# Altium project STB_LightBoard.PrjPcb (part 10 of 10)
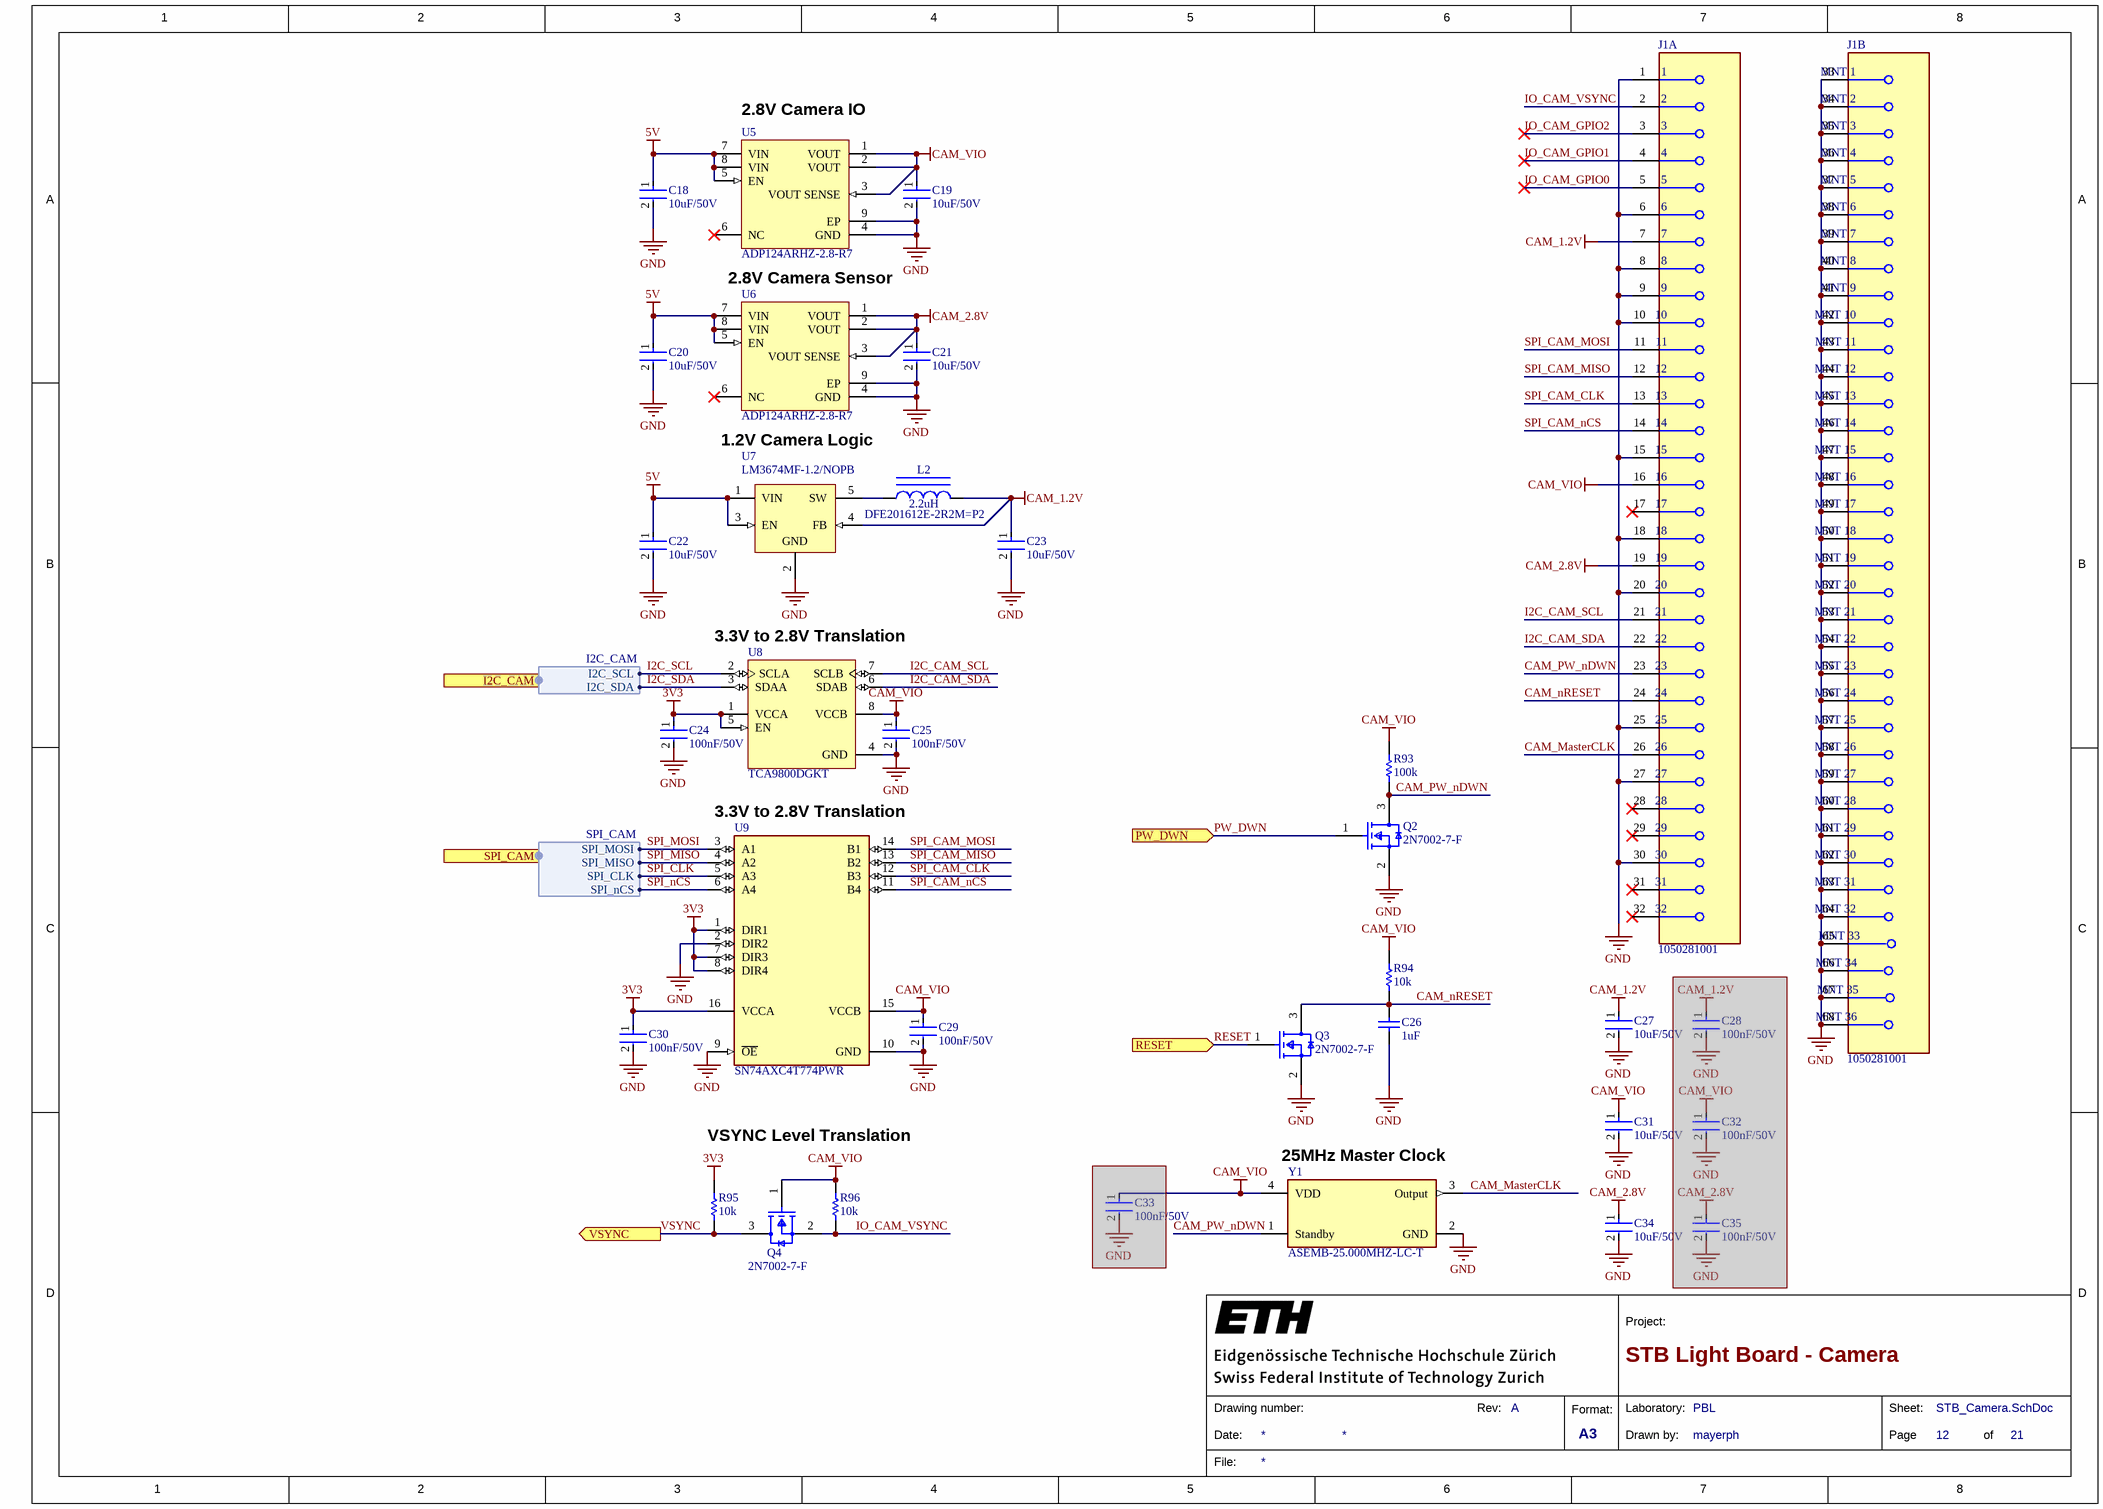
[diagram p21: STB_Camera.SchDoc]

## Nets that join several sheets
3V3: STB_LightBoard (X3.1), STB_UID (C4.2 U2.A1), TC1 (5 pins), TC2 (6 pins), LED_Driver_NE2G757GT (R85.2 R87.2), LG/D26 (5 pins), LED_Driver_QBHP686 (6 pins), LIR1/D15 (5 pins), LIR1/D16 (5 pins), LIR1/D17 (5 pins), LIR1/D18 (5 pins), LED_Driver_AREM-80C0 (R61.2 R62.2 R65.2 R66.2), LIR2/D19 (5 pins), LIR2/D20 (5 pins), LED_Driver_AREM-90C0 (8 pins), LIR3/D21 (5 pins), LIR3/D22 (5 pins), LIR3/D23 (5 pins), LIR3/D24 (5 pins), LED_Driver_NF2L757GT-F1 (5 pins), LW2/D10 (5 pins), LW2/D11 (5 pins), LW2/D12 (5 pins), LW2/D13 (5 pins), LW2/D14 (5 pins), LED_Driver_NF2W757GT-F1 (9 pins), LW1/D0 (5 pins), LW1/D1 (5 pins), LW1/D2 (5 pins), LW1/D3 (5 pins), LW1/D5 (5 pins), LW1/D6 (5 pins), LW1/D7 (5 pins), LW1/D4 (5 pins), LW1/D9 (5 pins), LW1/D8 (5 pins), LED_Driver_NE2R757GT-P6 (R89.2 R91.2), LR/D27 (5 pins), LED_Driver_NE2B757GT (R40.2 R42.2), LB/D25 (5 pins), STB_Camera (9 pins)
5V: STB_LightBoard (X3.19), STB_Camera (11 pins)
12V: STB_LightBoard (X3.17), TC1 (6 pins), TC2 (6 pins)
24V: STB_LightBoard (5 pins), LG/D26 (8 pins), LIR1/D15 (8 pins), LIR1/D16 (8 pins), LIR1/D17 (8 pins), LIR1/D18 (8 pins), LIR2/D19 (8 pins), LIR2/D20 (8 pins), LIR3/D21 (8 pins), LIR3/D22 (8 pins), LIR3/D23 (8 pins), LIR3/D24 (8 pins), LW2/D10 (8 pins), LW2/D11 (8 pins), LW2/D12 (8 pins), LW2/D13 (8 pins), LW2/D14 (8 pins), LW1/D0 (8 pins), LW1/D1 (8 pins), LW1/D2 (8 pins), LW1/D3 (8 pins), LW1/D5 (8 pins), LW1/D6 (8 pins), LW1/D7 (8 pins), LW1/D4 (8 pins), LW1/D9 (8 pins), LW1/D8 (8 pins), LR/D27 (8 pins), LB/D25 (8 pins)
GND: STB_LightBoard (7 pins), STB_UID (C4.1 U2.A2), TC1 (8 pins), TC2 (7 pins), LED_Driver_NE2G757GT (R86.1 R88.1), LG/D26 (20 pins), LED_Driver_QBHP686 (5 pins), LIR1/D15 (21 pins), LIR1/D16 (21 pins), LIR1/D17 (20 pins), LIR1/D18 (20 pins), LED_Driver_AREM-80C0 (R63.1 R64.1 R67.1 R68.1), LIR2/D19 (20 pins), LIR2/D20 (20 pins), LED_Driver_AREM-90C0 (8 pins), LIR3/D21 (20 pins), LIR3/D22 (20 pins), LIR3/D23 (20 pins), LIR3/D24 (20 pins), LED_Driver_NF2L757GT-F1 (5 pins), LW2/D10 (21 pins), LW2/D11 (21 pins), LW2/D12 (21 pins), LW2/D13 (21 pins), LW2/D14 (21 pins), LED_Driver_NF2W757GT-F1 (9 pins), LW1/D0 (22 pins), LW1/D1 (21 pins), LW1/D2 (21 pins), LW1/D3 (21 pins), LW1/D5 (21 pins), LW1/D6 (21 pins), LW1/D7 (21 pins), LW1/D4 (21 pins), LW1/D9 (21 pins), LW1/D8 (21 pins), LED_Driver_NE2R757GT-P6 (R90.1 R92.1), LR/D27 (20 pins), LED_Driver_NE2B757GT (R41.1 R43.1), LB/D25 (20 pins), STB_Camera (73 pins)
GPIO3: STB_LightBoard (X3.15), TC1 (R49_TC1.1 U1_TC1.9)
GPIO4: STB_LightBoard (X3.13), TC2 (R49_TC2.1 U1_TC2.9)
I2C_LIGHT_SCL: STB_LightBoard (X3.11), STB_UID (U2.B1), TC1 (U1_TC1.14), TC2 (U1_TC2.14), LG/D26 (U4_D26.10), LIR1/D15 (U4_D15.10), LIR1/D16 (U4_D16.10), LIR1/D17 (U4_D17.10), LIR1/D18 (U4_D18.10), LIR2/D19 (U4_D19.10), LIR2/D20 (U4_D20.10), LIR3/D21 (U4_D21.10), LIR3/D22 (U4_D22.10), LIR3/D23 (U4_D23.10), LIR3/D24 (U4_D24.10), LW2/D10 (U4_D10.10), LW2/D11 (U4_D11.10), LW2/D12 (U4_D12.10), LW2/D13 (U4_D13.10), LW2/D14 (U4_D14.10), LW1/D0 (U4_D0.10), LW1/D1 (U4_D1.10), LW1/D2 (U4_D2.10), LW1/D3 (U4_D3.10), LW1/D5 (U4_D5.10), LW1/D6 (U4_D6.10), LW1/D7 (U4_D7.10), LW1/D4 (U4_D4.10), LW1/D9 (U4_D9.10), LW1/D8 (U4_D8.10), LR/D27 (U4_D27.10), LB/D25 (U4_D25.10)
I2C_LIGHT_SDA: STB_LightBoard (X3.9), STB_UID (U2.B2), TC1 (U1_TC1.13), TC2 (U1_TC2.13), LG/D26 (U4_D26.7), LIR1/D15 (U4_D15.7), LIR1/D16 (U4_D16.7), LIR1/D17 (U4_D17.7), LIR1/D18 (U4_D18.7), LIR2/D19 (U4_D19.7), LIR2/D20 (U4_D20.7), LIR3/D21 (U4_D21.7), LIR3/D22 (U4_D22.7), LIR3/D23 (U4_D23.7), LIR3/D24 (U4_D24.7), LW2/D10 (U4_D10.7), LW2/D11 (U4_D11.7), LW2/D12 (U4_D12.7), LW2/D13 (U4_D13.7), LW2/D14 (U4_D14.7), LW1/D0 (U4_D0.7), LW1/D1 (U4_D1.7), LW1/D2 (U4_D2.7), LW1/D3 (U4_D3.7), LW1/D5 (U4_D5.7), LW1/D6 (U4_D6.7), LW1/D7 (U4_D7.7), LW1/D4 (U4_D4.7), LW1/D9 (U4_D9.7), LW1/D8 (U4_D8.7), LR/D27 (U4_D27.7), LB/D25 (U4_D25.7)
I2C_SCL: STB_LightBoard (X4.9), STB_Camera (U8.2)
I2C_SDA: STB_LightBoard (X4.7), STB_Camera (U8.3)
NetC7_D0_2: LW1/D0 (7 pins), LW1/W5_10 (LED65_W5_10.2), LW1/W5_11 (LED65_W5_11.2), LW1/W5_12 (LED65_W5_12.2), LW1/W5_13 (LED65_W5_13.2), LW1/W5_14 (LED65_W5_14.2), LW1/W5_15 (LED65_W5_15.2)
NetC7_D1_2: LW1/D1 (7 pins), LW1/W5_20 (LED65_W5_20.2), LW1/W5_21 (LED65_W5_21.2), LW1/W5_22 (LED65_W5_22.2), LW1/W5_23 (LED65_W5_23.2), LW1/W5_24 (LED65_W5_24.2), LW1/W5_25 (LED65_W5_25.2)
NetC7_D2_2: LW1/D2 (7 pins), LW1/W5_30 (LED65_W5_30.2), LW1/W5_31 (LED65_W5_31.2), LW1/W5_32 (LED65_W5_32.2), LW1/W5_33 (LED65_W5_33.2), LW1/W5_34 (LED65_W5_34.2), LW1/W5_35 (LED65_W5_35.2)
NetC7_D3_2: LW1/D3 (7 pins), LW1/W5_40 (LED65_W5_40.2), LW1/W5_41 (LED65_W5_41.2), LW1/W5_42 (LED65_W5_42.2), LW1/W5_43 (LED65_W5_43.2), LW1/W5_44 (LED65_W5_44.2), LW1/W5_45 (LED65_W5_45.2)
NetC7_D4_2: LW1/D4 (7 pins), LW1/W5_50 (LED65_W5_50.2), LW1/W5_51 (LED65_W5_51.2), LW1/W5_52 (LED65_W5_52.2), LW1/W5_53 (LED65_W5_53.2), LW1/W5_54 (LED65_W5_54.2), LW1/W5_55 (LED65_W5_55.2)
NetC7_D5_2: LW1/D5 (7 pins), LW1/W5_60 (LED65_W5_60.2), LW1/W5_61 (LED65_W5_61.2), LW1/W5_62 (LED65_W5_62.2), LW1/W5_63 (LED65_W5_63.2), LW1/W5_64 (LED65_W5_64.2), LW1/W5_65 (LED65_W5_65.2)
NetC7_D6_2: LW1/D6 (7 pins), LW1/W5_70 (LED65_W5_70.2), LW1/W5_71 (LED65_W5_71.2), LW1/W5_72 (LED65_W5_72.2), LW1/W5_73 (LED65_W5_73.2), LW1/W5_74 (LED65_W5_74.2), LW1/W5_75 (LED65_W5_75.2)
NetC7_D7_2: LW1/D7 (7 pins), LW1/W5_80 (LED65_W5_80.2), LW1/W5_81 (LED65_W5_81.2), LW1/W5_82 (LED65_W5_82.2), LW1/W5_83 (LED65_W5_83.2), LW1/W5_84 (LED65_W5_84.2), LW1/W5_85 (LED65_W5_85.2)
NetC7_D8_2: LW1/D8 (7 pins), LW1/W5_90 (LED65_W5_90.2), LW1/W5_91 (LED65_W5_91.2), LW1/W5_92 (LED65_W5_92.2), LW1/W5_93 (LED65_W5_93.2), LW1/W5_94 (LED65_W5_94.2), LW1/W5_95 (LED65_W5_95.2)
NetC7_D9_2: LW1/D9 (7 pins), LW1/W5_A0 (LED65_W5_A0.2), LW1/W5_A1 (LED65_W5_A1.2), LW1/W5_A2 (LED65_W5_A2.2), LW1/W5_A3 (LED65_W5_A3.2), LW1/W5_A4 (LED65_W5_A4.2), LW1/W5_A5 (LED65_W5_A5.2)
NetC7_D10_2: LW2/D10 (7 pins), LW2/W3_10 (LED90_W3_10.2), LW2/W3_11 (LED90_W3_11.2), LW2/W3_12 (LED90_W3_12.2), LW2/W3_13 (LED90_W3_13.2), LW2/W3_14 (LED90_W3_14.2), LW2/W3_15 (LED90_W3_15.2)
NetC7_D11_2: LW2/D11 (7 pins), LW2/W3_20 (LED90_W3_20.2), LW2/W3_21 (LED90_W3_21.2), LW2/W3_22 (LED90_W3_22.2), LW2/W3_23 (LED90_W3_23.2), LW2/W3_24 (LED90_W3_24.2), LW2/W3_25 (LED90_W3_25.2)
NetC7_D12_2: LW2/D12 (7 pins), LW2/W3_30 (LED90_W3_30.2), LW2/W3_31 (LED90_W3_31.2), LW2/W3_32 (LED90_W3_32.2), LW2/W3_33 (LED90_W3_33.2), LW2/W3_34 (LED90_W3_34.2), LW2/W3_35 (LED90_W3_35.2)
NetC7_D13_2: LW2/D13 (7 pins), LW2/W3_40 (LED90_W3_40.2), LW2/W3_41 (LED90_W3_41.2), LW2/W3_42 (LED90_W3_42.2), LW2/W3_43 (LED90_W3_43.2), LW2/W3_44 (LED90_W3_44.2), LW2/W3_45 (LED90_W3_45.2)
NetC7_D14_2: LW2/D14 (7 pins), LW2/W3_50 (LED90_W3_50.2), LW2/W3_51 (LED90_W3_51.2), LW2/W3_52 (LED90_W3_52.2), LW2/W3_53 (LED90_W3_53.2), LW2/W3_54 (LED90_W3_54.2), LW2/W3_55 (LED90_W3_55.2)
NetC7_D15_2: LIR1/D15 (7 pins), LIR1/IR740_10 (LED43_IR740_10.2), LIR1/IR740_11 (LED43_IR740_11.2), LIR1/IR740_12 (LED43_IR740_12.2), LIR1/IR740_13 (LED43_IR740_13.2), LIR1/IR740_14 (LED43_IR740_14.2), LIR1/IR740_15 (LED43_IR740_15.2)
NetC7_D16_2: LIR1/D16 (7 pins), LIR1/IR740_20 (LED43_IR740_20.2), LIR1/IR740_21 (LED43_IR740_21.2), LIR1/IR740_22 (LED43_IR740_22.2), LIR1/IR740_23 (LED43_IR740_23.2), LIR1/IR740_24 (LED43_IR740_24.2), LIR1/IR740_25 (LED43_IR740_25.2)
NetC7_D17_2: LIR1/D17 (7 pins), LIR1/IR740_30 (LED43_IR740_30.2), LIR1/IR740_31 (LED43_IR740_31.2), LIR1/IR740_32 (LED43_IR740_32.2), LIR1/IR740_33 (LED43_IR740_33.2), LIR1/IR740_34 (LED43_IR740_34.2), LIR1/IR740_35 (LED43_IR740_35.2)
NetC7_D18_2: LIR1/D18 (7 pins), LIR1/IR740_40 (LED43_IR740_40.2), LIR1/IR740_41 (LED43_IR740_41.2), LIR1/IR740_42 (LED43_IR740_42.2), LIR1/IR740_43 (LED43_IR740_43.2), LIR1/IR740_44 (LED43_IR740_44.2), LIR1/IR740_45 (LED43_IR740_45.2)
NetC7_D19_2: LIR2/D19 (7 pins), LIR2/IR850_10 (LED104_IR850_10.2), LIR2/IR850_11 (LED104_IR850_11.2), LIR2/IR850_12 (LED104_IR850_12.2), LIR2/IR850_13 (LED104_IR850_13.2), LIR2/IR850_14 (LED104_IR850_14.2), LIR2/IR850_15 (LED104_IR850_15.2)
NetC7_D20_2: LIR2/D20 (7 pins), LIR2/IR850_20 (LED104_IR850_20.2), LIR2/IR850_21 (LED104_IR850_21.2), LIR2/IR850_22 (LED104_IR850_22.2), LIR2/IR850_23 (LED104_IR850_23.2), LIR2/IR850_24 (LED104_IR850_24.2), LIR2/IR850_25 (LED104_IR850_25.2)
NetC7_D21_2: LIR3/D21 (7 pins), LIR3/IR940_10 (LED15_IR940_10.2), LIR3/IR940_11 (LED15_IR940_11.2), LIR3/IR940_12 (LED15_IR940_12.2), LIR3/IR940_13 (LED15_IR940_13.2), LIR3/IR940_14 (LED15_IR940_14.2), LIR3/IR940_15 (LED15_IR940_15.2)
NetC7_D22_2: LIR3/D22 (7 pins), LIR3/IR940_20 (LED15_IR940_20.2), LIR3/IR940_21 (LED15_IR940_21.2), LIR3/IR940_22 (LED15_IR940_22.2), LIR3/IR940_23 (LED15_IR940_23.2), LIR3/IR940_24 (LED15_IR940_24.2), LIR3/IR940_25 (LED15_IR940_25.2)
NetC7_D23_2: LIR3/D23 (7 pins), LIR3/IR940_30 (LED15_IR940_30.2), LIR3/IR940_31 (LED15_IR940_31.2), LIR3/IR940_32 (LED15_IR940_32.2), LIR3/IR940_33 (LED15_IR940_33.2), LIR3/IR940_34 (LED15_IR940_34.2), LIR3/IR940_35 (LED15_IR940_35.2)
NetC7_D24_2: LIR3/D24 (7 pins), LIR3/IR940_40 (LED15_IR940_40.2), LIR3/IR940_41 (LED15_IR940_41.2), LIR3/IR940_42 (LED15_IR940_42.2), LIR3/IR940_43 (LED15_IR940_43.2), LIR3/IR940_44 (LED15_IR940_44.2), LIR3/IR940_45 (LED15_IR940_45.2)
NetC7_D25_2: LB/D25 (7 pins), LB/b_10 (LED135_b_10.2), LB/b_11 (LED135_b_11.2), LB/b_12 (LED135_b_12.2), LB/b_13 (LED135_b_13.2), LB/b_14 (LED135_b_14.2), LB/b_15 (LED135_b_15.2)
NetC7_D26_2: LG/D26 (7 pins), LG/g_10 (LED78_g_10.2), LG/g_11 (LED78_g_11.2), LG/g_12 (LED78_g_12.2), LG/g_13 (LED78_g_13.2), LG/g_14 (LED78_g_14.2), LG/g_15 (LED78_g_15.2)
NetC7_D27_2: LR/D27 (7 pins), LR/r_10 (LED1_r_10.2), LR/r_11 (LED1_r_11.2), LR/r_12 (LED1_r_12.2), LR/r_13 (LED1_r_13.2), LR/r_14 (LED1_r_14.2), LR/r_15 (LED1_r_15.2)
NetLED41_IR940_10_1: LIR3/D21 (U3_D21.10), LIR3/IR940_10 (LED41_IR940_10.1)
NetLED41_IR940_11_1: LIR3/D21 (U3_D21.11), LIR3/IR940_11 (LED41_IR940_11.1)
NetLED41_IR940_12_1: LIR3/D21 (U3_D21.12), LIR3/IR940_12 (LED41_IR940_12.1)
NetLED41_IR940_13_1: LIR3/D21 (U3_D21.13), LIR3/IR940_13 (LED41_IR940_13.1)
NetLED41_IR940_14_1: LIR3/D21 (U3_D21.14), LIR3/IR940_14 (LED41_IR940_14.1)
NetLED41_IR940_15_1: LIR3/D21 (U3_D21.15), LIR3/IR940_15 (LED41_IR940_15.1)
NetLED41_IR940_20_1: LIR3/D22 (U3_D22.10), LIR3/IR940_20 (LED41_IR940_20.1)
NetLED41_IR940_21_1: LIR3/D22 (U3_D22.11), LIR3/IR940_21 (LED41_IR940_21.1)
NetLED41_IR940_22_1: LIR3/D22 (U3_D22.12), LIR3/IR940_22 (LED41_IR940_22.1)
NetLED41_IR940_23_1: LIR3/D22 (U3_D22.13), LIR3/IR940_23 (LED41_IR940_23.1)
NetLED41_IR940_24_1: LIR3/D22 (U3_D22.14), LIR3/IR940_24 (LED41_IR940_24.1)
NetLED41_IR940_25_1: LIR3/D22 (U3_D22.15), LIR3/IR940_25 (LED41_IR940_25.1)
NetLED41_IR940_30_1: LIR3/D23 (U3_D23.10), LIR3/IR940_30 (LED41_IR940_30.1)
NetLED41_IR940_31_1: LIR3/D23 (U3_D23.11), LIR3/IR940_31 (LED41_IR940_31.1)
NetLED41_IR940_32_1: LIR3/D23 (U3_D23.12), LIR3/IR940_32 (LED41_IR940_32.1)
NetLED41_IR940_33_1: LIR3/D23 (U3_D23.13), LIR3/IR940_33 (LED41_IR940_33.1)
NetLED41_IR940_34_1: LIR3/D23 (U3_D23.14), LIR3/IR940_34 (LED41_IR940_34.1)
NetLED41_IR940_35_1: LIR3/D23 (U3_D23.15), LIR3/IR940_35 (LED41_IR940_35.1)
NetLED41_IR940_40_1: LIR3/D24 (U3_D24.10), LIR3/IR940_40 (LED41_IR940_40.1)
NetLED41_IR940_41_1: LIR3/D24 (U3_D24.11), LIR3/IR940_41 (LED41_IR940_41.1)
NetLED41_IR940_42_1: LIR3/D24 (U3_D24.12), LIR3/IR940_42 (LED41_IR940_42.1)
NetLED41_IR940_43_1: LIR3/D24 (U3_D24.13), LIR3/IR940_43 (LED41_IR940_43.1)
NetLED41_IR940_44_1: LIR3/D24 (U3_D24.14), LIR3/IR940_44 (LED41_IR940_44.1)
NetLED41_IR940_45_1: LIR3/D24 (U3_D24.15), LIR3/IR940_45 (LED41_IR940_45.1)
NetLED64_IR740_10_1: LIR1/D15 (U3_D15.10), LIR1/IR740_10 (LED64_IR740_10.1)
NetLED64_IR740_11_1: LIR1/D15 (U3_D15.11), LIR1/IR740_11 (LED64_IR740_11.1)
NetLED64_IR740_12_1: LIR1/D15 (U3_D15.12), LIR1/IR740_12 (LED64_IR740_12.1)
NetLED64_IR740_13_1: LIR1/D15 (U3_D15.13), LIR1/IR740_13 (LED64_IR740_13.1)
NetLED64_IR740_14_1: LIR1/D15 (U3_D15.14), LIR1/IR740_14 (LED64_IR740_14.1)
NetLED64_IR740_15_1: LIR1/D15 (U3_D15.15), LIR1/IR740_15 (LED64_IR740_15.1)
NetLED64_IR740_20_1: LIR1/D16 (U3_D16.10), LIR1/IR740_20 (LED64_IR740_20.1)
NetLED64_IR740_21_1: LIR1/D16 (U3_D16.11), LIR1/IR740_21 (LED64_IR740_21.1)
NetLED64_IR740_22_1: LIR1/D16 (U3_D16.12), LIR1/IR740_22 (LED64_IR740_22.1)
NetLED64_IR740_23_1: LIR1/D16 (U3_D16.13), LIR1/IR740_23 (LED64_IR740_23.1)
NetLED64_IR740_24_1: LIR1/D16 (U3_D16.14), LIR1/IR740_24 (LED64_IR740_24.1)
NetLED64_IR740_25_1: LIR1/D16 (U3_D16.15), LIR1/IR740_25 (LED64_IR740_25.1)
NetLED64_IR740_30_1: LIR1/D17 (U3_D17.10), LIR1/IR740_30 (LED64_IR740_30.1)
NetLED64_IR740_31_1: LIR1/D17 (U3_D17.11), LIR1/IR740_31 (LED64_IR740_31.1)
NetLED64_IR740_32_1: LIR1/D17 (U3_D17.12), LIR1/IR740_32 (LED64_IR740_32.1)
NetLED64_IR740_33_1: LIR1/D17 (U3_D17.13), LIR1/IR740_33 (LED64_IR740_33.1)
NetLED64_IR740_34_1: LIR1/D17 (U3_D17.14), LIR1/IR740_34 (LED64_IR740_34.1)
NetLED64_IR740_35_1: LIR1/D17 (U3_D17.15), LIR1/IR740_35 (LED64_IR740_35.1)
NetLED64_IR740_40_1: LIR1/D18 (U3_D18.10), LIR1/IR740_40 (LED64_IR740_40.1)
NetLED64_IR740_41_1: LIR1/D18 (U3_D18.11), LIR1/IR740_41 (LED64_IR740_41.1)
NetLED64_IR740_42_1: LIR1/D18 (U3_D18.12), LIR1/IR740_42 (LED64_IR740_42.1)
NetLED64_IR740_43_1: LIR1/D18 (U3_D18.13), LIR1/IR740_43 (LED64_IR740_43.1)
NetLED64_IR740_44_1: LIR1/D18 (U3_D18.14), LIR1/IR740_44 (LED64_IR740_44.1)
NetLED64_IR740_45_1: LIR1/D18 (U3_D18.15), LIR1/IR740_45 (LED64_IR740_45.1)
NetLED77_W5_10_1: LW1/D0 (U3_D0.10), LW1/W5_10 (LED77_W5_10.1)
NetLED77_W5_11_1: LW1/D0 (U3_D0.11), LW1/W5_11 (LED77_W5_11.1)
NetLED77_W5_12_1: LW1/D0 (U3_D0.12), LW1/W5_12 (LED77_W5_12.1)
NetLED77_W5_13_1: LW1/D0 (U3_D0.13), LW1/W5_13 (LED77_W5_13.1)
NetLED77_W5_14_1: LW1/D0 (U3_D0.14), LW1/W5_14 (LED77_W5_14.1)
NetLED77_W5_15_1: LW1/D0 (U3_D0.15), LW1/W5_15 (LED77_W5_15.1)
NetLED77_W5_20_1: LW1/D1 (U3_D1.10), LW1/W5_20 (LED77_W5_20.1)
NetLED77_W5_21_1: LW1/D1 (U3_D1.11), LW1/W5_21 (LED77_W5_21.1)
NetLED77_W5_22_1: LW1/D1 (U3_D1.12), LW1/W5_22 (LED77_W5_22.1)
NetLED77_W5_23_1: LW1/D1 (U3_D1.13), LW1/W5_23 (LED77_W5_23.1)
NetLED77_W5_24_1: LW1/D1 (U3_D1.14), LW1/W5_24 (LED77_W5_24.1)
NetLED77_W5_25_1: LW1/D1 (U3_D1.15), LW1/W5_25 (LED77_W5_25.1)
NetLED77_W5_30_1: LW1/D2 (U3_D2.10), LW1/W5_30 (LED77_W5_30.1)
NetLED77_W5_31_1: LW1/D2 (U3_D2.11), LW1/W5_31 (LED77_W5_31.1)
NetLED77_W5_32_1: LW1/D2 (U3_D2.12), LW1/W5_32 (LED77_W5_32.1)
NetLED77_W5_33_1: LW1/D2 (U3_D2.13), LW1/W5_33 (LED77_W5_33.1)
NetLED77_W5_34_1: LW1/D2 (U3_D2.14), LW1/W5_34 (LED77_W5_34.1)
NetLED77_W5_35_1: LW1/D2 (U3_D2.15), LW1/W5_35 (LED77_W5_35.1)
NetLED77_W5_40_1: LW1/D3 (U3_D3.10), LW1/W5_40 (LED77_W5_40.1)
NetLED77_W5_41_1: LW1/D3 (U3_D3.11), LW1/W5_41 (LED77_W5_41.1)
NetLED77_W5_42_1: LW1/D3 (U3_D3.12), LW1/W5_42 (LED77_W5_42.1)
NetLED77_W5_43_1: LW1/D3 (U3_D3.13), LW1/W5_43 (LED77_W5_43.1)
NetLED77_W5_44_1: LW1/D3 (U3_D3.14), LW1/W5_44 (LED77_W5_44.1)
NetLED77_W5_45_1: LW1/D3 (U3_D3.15), LW1/W5_45 (LED77_W5_45.1)
NetLED77_W5_50_1: LW1/D4 (U3_D4.10), LW1/W5_50 (LED77_W5_50.1)
NetLED77_W5_51_1: LW1/D4 (U3_D4.11), LW1/W5_51 (LED77_W5_51.1)
NetLED77_W5_52_1: LW1/D4 (U3_D4.12), LW1/W5_52 (LED77_W5_52.1)
NetLED77_W5_53_1: LW1/D4 (U3_D4.13), LW1/W5_53 (LED77_W5_53.1)
NetLED77_W5_54_1: LW1/D4 (U3_D4.14), LW1/W5_54 (LED77_W5_54.1)
NetLED77_W5_55_1: LW1/D4 (U3_D4.15), LW1/W5_55 (LED77_W5_55.1)
NetLED77_W5_60_1: LW1/D5 (U3_D5.10), LW1/W5_60 (LED77_W5_60.1)
NetLED77_W5_61_1: LW1/D5 (U3_D5.11), LW1/W5_61 (LED77_W5_61.1)
NetLED77_W5_62_1: LW1/D5 (U3_D5.12), LW1/W5_62 (LED77_W5_62.1)
NetLED77_W5_63_1: LW1/D5 (U3_D5.13), LW1/W5_63 (LED77_W5_63.1)
NetLED77_W5_64_1: LW1/D5 (U3_D5.14), LW1/W5_64 (LED77_W5_64.1)
NetLED77_W5_65_1: LW1/D5 (U3_D5.15), LW1/W5_65 (LED77_W5_65.1)
NetLED77_W5_70_1: LW1/D6 (U3_D6.10), LW1/W5_70 (LED77_W5_70.1)
NetLED77_W5_71_1: LW1/D6 (U3_D6.11), LW1/W5_71 (LED77_W5_71.1)
NetLED77_W5_72_1: LW1/D6 (U3_D6.12), LW1/W5_72 (LED77_W5_72.1)
NetLED77_W5_73_1: LW1/D6 (U3_D6.13), LW1/W5_73 (LED77_W5_73.1)
NetLED77_W5_74_1: LW1/D6 (U3_D6.14), LW1/W5_74 (LED77_W5_74.1)
NetLED77_W5_75_1: LW1/D6 (U3_D6.15), LW1/W5_75 (LED77_W5_75.1)
NetLED77_W5_80_1: LW1/D7 (U3_D7.10), LW1/W5_80 (LED77_W5_80.1)
NetLED77_W5_81_1: LW1/D7 (U3_D7.11), LW1/W5_81 (LED77_W5_81.1)
NetLED77_W5_82_1: LW1/D7 (U3_D7.12), LW1/W5_82 (LED77_W5_82.1)
NetLED77_W5_83_1: LW1/D7 (U3_D7.13), LW1/W5_83 (LED77_W5_83.1)
NetLED77_W5_84_1: LW1/D7 (U3_D7.14), LW1/W5_84 (LED77_W5_84.1)
NetLED77_W5_85_1: LW1/D7 (U3_D7.15), LW1/W5_85 (LED77_W5_85.1)
NetLED77_W5_90_1: LW1/D8 (U3_D8.10), LW1/W5_90 (LED77_W5_90.1)
NetLED77_W5_91_1: LW1/D8 (U3_D8.11), LW1/W5_91 (LED77_W5_91.1)
NetLED77_W5_92_1: LW1/D8 (U3_D8.12), LW1/W5_92 (LED77_W5_92.1)
NetLED77_W5_93_1: LW1/D8 (U3_D8.13), LW1/W5_93 (LED77_W5_93.1)
NetLED77_W5_94_1: LW1/D8 (U3_D8.14), LW1/W5_94 (LED77_W5_94.1)
NetLED77_W5_95_1: LW1/D8 (U3_D8.15), LW1/W5_95 (LED77_W5_95.1)
NetLED77_W5_A0_1: LW1/D9 (U3_D9.10), LW1/W5_A0 (LED77_W5_A0.1)
NetLED77_W5_A1_1: LW1/D9 (U3_D9.11), LW1/W5_A1 (LED77_W5_A1.1)
NetLED77_W5_A2_1: LW1/D9 (U3_D9.12), LW1/W5_A2 (LED77_W5_A2.1)
NetLED77_W5_A3_1: LW1/D9 (U3_D9.13), LW1/W5_A3 (LED77_W5_A3.1)
NetLED77_W5_A4_1: LW1/D9 (U3_D9.14), LW1/W5_A4 (LED77_W5_A4.1)
NetLED77_W5_A5_1: LW1/D9 (U3_D9.15), LW1/W5_A5 (LED77_W5_A5.1)
NetLED89_g_10_1: LG/D26 (U3_D26.10), LG/g_10 (LED89_g_10.1)
NetLED89_g_11_1: LG/D26 (U3_D26.11), LG/g_11 (LED89_g_11.1)
NetLED89_g_12_1: LG/D26 (U3_D26.12), LG/g_12 (LED89_g_12.1)
NetLED89_g_13_1: LG/D26 (U3_D26.13), LG/g_13 (LED89_g_13.1)
NetLED89_g_14_1: LG/D26 (U3_D26.14), LG/g_14 (LED89_g_14.1)
NetLED89_g_15_1: LG/D26 (U3_D26.15), LG/g_15 (LED89_g_15.1)
NetLED103_W3_10_1: LW2/D10 (U3_D10.10), LW2/W3_10 (LED103_W3_10.1)
NetLED103_W3_11_1: LW2/D10 (U3_D10.11), LW2/W3_11 (LED103_W3_11.1)
NetLED103_W3_12_1: LW2/D10 (U3_D10.12), LW2/W3_12 (LED103_W3_12.1)
NetLED103_W3_13_1: LW2/D10 (U3_D10.13), LW2/W3_13 (LED103_W3_13.1)
NetLED103_W3_14_1: LW2/D10 (U3_D10.14), LW2/W3_14 (LED103_W3_14.1)
NetLED103_W3_15_1: LW2/D10 (U3_D10.15), LW2/W3_15 (LED103_W3_15.1)
NetLED103_W3_20_1: LW2/D11 (U3_D11.10), LW2/W3_20 (LED103_W3_20.1)
NetLED103_W3_21_1: LW2/D11 (U3_D11.11), LW2/W3_21 (LED103_W3_21.1)
NetLED103_W3_22_1: LW2/D11 (U3_D11.12), LW2/W3_22 (LED103_W3_22.1)
NetLED103_W3_23_1: LW2/D11 (U3_D11.13), LW2/W3_23 (LED103_W3_23.1)
NetLED103_W3_24_1: LW2/D11 (U3_D11.14), LW2/W3_24 (LED103_W3_24.1)
NetLED103_W3_25_1: LW2/D11 (U3_D11.15), LW2/W3_25 (LED103_W3_25.1)
NetLED103_W3_30_1: LW2/D12 (U3_D12.10), LW2/W3_30 (LED103_W3_30.1)
NetLED103_W3_31_1: LW2/D12 (U3_D12.11), LW2/W3_31 (LED103_W3_31.1)
NetLED103_W3_32_1: LW2/D12 (U3_D12.12), LW2/W3_32 (LED103_W3_32.1)
NetLED103_W3_33_1: LW2/D12 (U3_D12.13), LW2/W3_33 (LED103_W3_33.1)
NetLED103_W3_34_1: LW2/D12 (U3_D12.14), LW2/W3_34 (LED103_W3_34.1)
NetLED103_W3_35_1: LW2/D12 (U3_D12.15), LW2/W3_35 (LED103_W3_35.1)
NetLED103_W3_40_1: LW2/D13 (U3_D13.10), LW2/W3_40 (LED103_W3_40.1)
NetLED103_W3_41_1: LW2/D13 (U3_D13.11), LW2/W3_41 (LED103_W3_41.1)
NetLED103_W3_42_1: LW2/D13 (U3_D13.12), LW2/W3_42 (LED103_W3_42.1)
NetLED103_W3_43_1: LW2/D13 (U3_D13.13), LW2/W3_43 (LED103_W3_43.1)
NetLED103_W3_44_1: LW2/D13 (U3_D13.14), LW2/W3_44 (LED103_W3_44.1)
NetLED103_W3_45_1: LW2/D13 (U3_D13.15), LW2/W3_45 (LED103_W3_45.1)
NetLED103_W3_50_1: LW2/D14 (U3_D14.10), LW2/W3_50 (LED103_W3_50.1)
NetLED103_W3_51_1: LW2/D14 (U3_D14.11), LW2/W3_51 (LED103_W3_51.1)
NetLED103_W3_52_1: LW2/D14 (U3_D14.12), LW2/W3_52 (LED103_W3_52.1)
NetLED103_W3_53_1: LW2/D14 (U3_D14.13), LW2/W3_53 (LED103_W3_53.1)
NetLED103_W3_54_1: LW2/D14 (U3_D14.14), LW2/W3_54 (LED103_W3_54.1)
NetLED103_W3_55_1: LW2/D14 (U3_D14.15), LW2/W3_55 (LED103_W3_55.1)
NetLED129_IR850_10_1: LIR2/D19 (U3_D19.10), LIR2/IR850_10 (LED129_IR850_10.1)
NetLED129_IR850_11_1: LIR2/D19 (U3_D19.11), LIR2/IR850_11 (LED129_IR850_11.1)
NetLED129_IR850_12_1: LIR2/D19 (U3_D19.12), LIR2/IR850_12 (LED129_IR850_12.1)
NetLED129_IR850_13_1: LIR2/D19 (U3_D19.13), LIR2/IR850_13 (LED129_IR850_13.1)
NetLED129_IR850_14_1: LIR2/D19 (U3_D19.14), LIR2/IR850_14 (LED129_IR850_14.1)
NetLED129_IR850_15_1: LIR2/D19 (U3_D19.15), LIR2/IR850_15 (LED129_IR850_15.1)
NetLED129_IR850_20_1: LIR2/D20 (U3_D20.10), LIR2/IR850_20 (LED129_IR850_20.1)
NetLED129_IR850_21_1: LIR2/D20 (U3_D20.11), LIR2/IR850_21 (LED129_IR850_21.1)
NetLED129_IR850_22_1: LIR2/D20 (U3_D20.12), LIR2/IR850_22 (LED129_IR850_22.1)
NetLED129_IR850_23_1: LIR2/D20 (U3_D20.13), LIR2/IR850_23 (LED129_IR850_23.1)
NetLED129_IR850_24_1: LIR2/D20 (U3_D20.14), LIR2/IR850_24 (LED129_IR850_24.1)
NetLED129_IR850_25_1: LIR2/D20 (U3_D20.15), LIR2/IR850_25 (LED129_IR850_25.1)
NetLED134_r_10_1: LR/D27 (U3_D27.10), LR/r_10 (LED134_r_10.1)
NetLED134_r_11_1: LR/D27 (U3_D27.11), LR/r_11 (LED134_r_11.1)
NetLED134_r_12_1: LR/D27 (U3_D27.12), LR/r_12 (LED134_r_12.1)
NetLED134_r_13_1: LR/D27 (U3_D27.13), LR/r_13 (LED134_r_13.1)
NetLED134_r_14_1: LR/D27 (U3_D27.14), LR/r_14 (LED134_r_14.1)
NetLED134_r_15_1: LR/D27 (U3_D27.15), LR/r_15 (LED134_r_15.1)
NetLED148_b_10_1: LB/D25 (U3_D25.10), LB/b_10 (LED148_b_10.1)
NetLED148_b_11_1: LB/D25 (U3_D25.11), LB/b_11 (LED148_b_11.1)
NetLED148_b_12_1: LB/D25 (U3_D25.12), LB/b_12 (LED148_b_12.1)
NetLED148_b_13_1: LB/D25 (U3_D25.13), LB/b_13 (LED148_b_13.1)
NetLED148_b_14_1: LB/D25 (U3_D25.14), LB/b_14 (LED148_b_14.1)
NetLED148_b_15_1: LB/D25 (U3_D25.15), LB/b_15 (LED148_b_15.1)
NetR1_1: LED_Driver_QBHP686 (R1.1 R4.2), LIR1/D18 (U4_D18.3)
NetR2_1: LED_Driver_QBHP686 (R2.1), LIR1/D15 (U4_D15.3)
NetR3_1: LED_Driver_QBHP686 (R3.1 R5.2), LIR1/D17 (U4_D17.3)
NetR6_1: LED_Driver_QBHP686 (R6.1 R9.2), LIR1/D18 (U4_D18.2)
NetR7_1: LED_Driver_QBHP686 (R7.1 R10.2), LIR1/D16 (U4_D16.2)
NetR8_1: LED_Driver_QBHP686 (R8.1 R11.2), LIR1/D17 (U4_D17.2)
NetR12_1: LED_Driver_NF2L757GT-F1 (R12.1 R16.2), LW2/D13 (U4_D13.3)
NetR13_1: LED_Driver_NF2L757GT-F1 (R13.1 R17.2), LW2/D10 (U4_D10.3)
NetR14_1: LED_Driver_NF2L757GT-F1 (R14.1 R18.2), LW2/D11 (U4_D11.3)
NetR15_1: LED_Driver_NF2L757GT-F1 (R15.1 R19.2), LW2/D12 (U4_D12.3)
NetR20_1: LED_Driver_NF2L757GT-F1 (R20.1 R21.2), LW2/D14 (U4_D14.3)
NetR22_1: LED_Driver_NF2W757GT-F1 (R22.1 R25.2), LW1/D3 (U4_D3.3)
NetR23_1: LED_Driver_NF2W757GT-F1 (R23.1 R26.2), LW1/D1 (U4_D1.3)
NetR24_1: LED_Driver_NF2W757GT-F1 (R24.1 R27.2), LW1/D2 (U4_D2.3)
NetR28_1: LED_Driver_NF2W757GT-F1 (R28.1 R32.2), LW1/D7 (U4_D7.3)
NetR29_1: LED_Driver_NF2W757GT-F1 (R29.1 R33.2), LW1/D4 (U4_D4.3)
NetR30_1: LED_Driver_NF2W757GT-F1 (R30.1 R34.2), LW1/D5 (U4_D5.3)
NetR31_1: LED_Driver_NF2W757GT-F1 (R31.1 R35.2), LW1/D6 (U4_D6.3)
NetR36_1: LED_Driver_NF2W757GT-F1 (R36.1 R38.2), LW1/D8 (U4_D8.3)
NetR37_1: LED_Driver_NF2W757GT-F1 (R37.1 R39.2), LW1/D9 (U4_D9.3)
NetR40_1: LED_Driver_NE2B757GT (R40.1 R41.2), LB/D25 (U4_D25.3)
NetR42_1: LED_Driver_NE2B757GT (R42.1 R43.2), LB/D25 (U4_D25.2)
NetR48_TC1_1: STB_LightBoard (TP1.TP), TC1 (R48_TC1.1 U1_TC1.11)
NetR48_TC2_1: STB_LightBoard (TP2.TP), TC2 (R48_TC2.1 U1_TC2.11)
NetR61_1: LED_Driver_AREM-80C0 (R61.1 R63.2), LIR2/D19 (U4_D19.3)
NetR62_1: LED_Driver_AREM-80C0 (R62.1 R64.2), LIR2/D20 (U4_D20.3)
NetR65_1: LED_Driver_AREM-80C0 (R65.1 R67.2), LIR2/D19 (U4_D19.2)
NetR66_1: LED_Driver_AREM-80C0 (R66.1 R68.2), LIR2/D20 (U4_D20.2)
NetR69_1: LED_Driver_AREM-90C0 (R69.1 R73.2), LIR3/D24 (U4_D24.3)
NetR70_1: LED_Driver_AREM-90C0 (R70.1 R74.2), LIR3/D21 (U4_D21.3)
NetR71_1: LED_Driver_AREM-90C0 (R71.1 R75.2), LIR3/D22 (U4_D22.3)
NetR72_1: LED_Driver_AREM-90C0 (R72.1 R76.2), LIR3/D23 (U4_D23.3)
NetR77_1: LED_Driver_AREM-90C0 (R77.1 R81.2), LIR3/D24 (U4_D24.2)
NetR78_1: LED_Driver_AREM-90C0 (R78.1 R82.2), LIR3/D21 (U4_D21.2)
NetR79_1: LED_Driver_AREM-90C0 (R79.1 R83.2), LIR3/D22 (U4_D22.2)
NetR80_1: LED_Driver_AREM-90C0 (R80.1 R84.2), LIR3/D23 (U4_D23.2)
NetR85_1: LED_Driver_NE2G757GT (R85.1 R86.2), LG/D26 (U4_D26.3)
NetR87_1: LED_Driver_NE2G757GT (R87.1 R88.2), LG/D26 (U4_D26.2)
NetR89_1: LED_Driver_NE2R757GT-P6 (R89.1 R90.2), LR/D27 (U4_D27.3)
NetR91_1: LED_Driver_NE2R757GT-P6 (R91.1 R92.2), LR/D27 (U4_D27.2)
PW_DWN: STB_LightBoard (X4.5), STB_Camera (Q2.1)
RESET: STB_LightBoard (X4.3), STB_Camera (Q3.1)
SPI_CLK: STB_LightBoard (X4.6), STB_Camera (U9.5)
SPI_MISO: STB_LightBoard (X4.8), STB_Camera (U9.4)
SPI_MOSI: STB_LightBoard (X4.10), STB_Camera (U9.3)
SPI_nCS: STB_LightBoard (X4.4), STB_Camera (U9.6)
VSYNC: STB_LightBoard (X4.2), STB_Camera (Q4.3 R95.2)